# Altium schematic sheet INPUT BUFFER.SchDoc
size A3; CheckedBy: Alain.Zhu; CompanyName: TYMPHANY; DrawnBy: Yetta.He; Organization: PABU-BL3; Address1: 11F,block A, CEC building,; Address2: No.2070 Shennan Zhong road,; Address3: Huaqiang North, Futian District,; Address4: Shenzhen,  Guang Dong, P.R.C 518000; DocumentNumber: 5; Revision: 1.0.0; SheetNumber: 5; SheetTotal: 8; Size: A3; PCB By: Yetta.He; Status: DP1.1
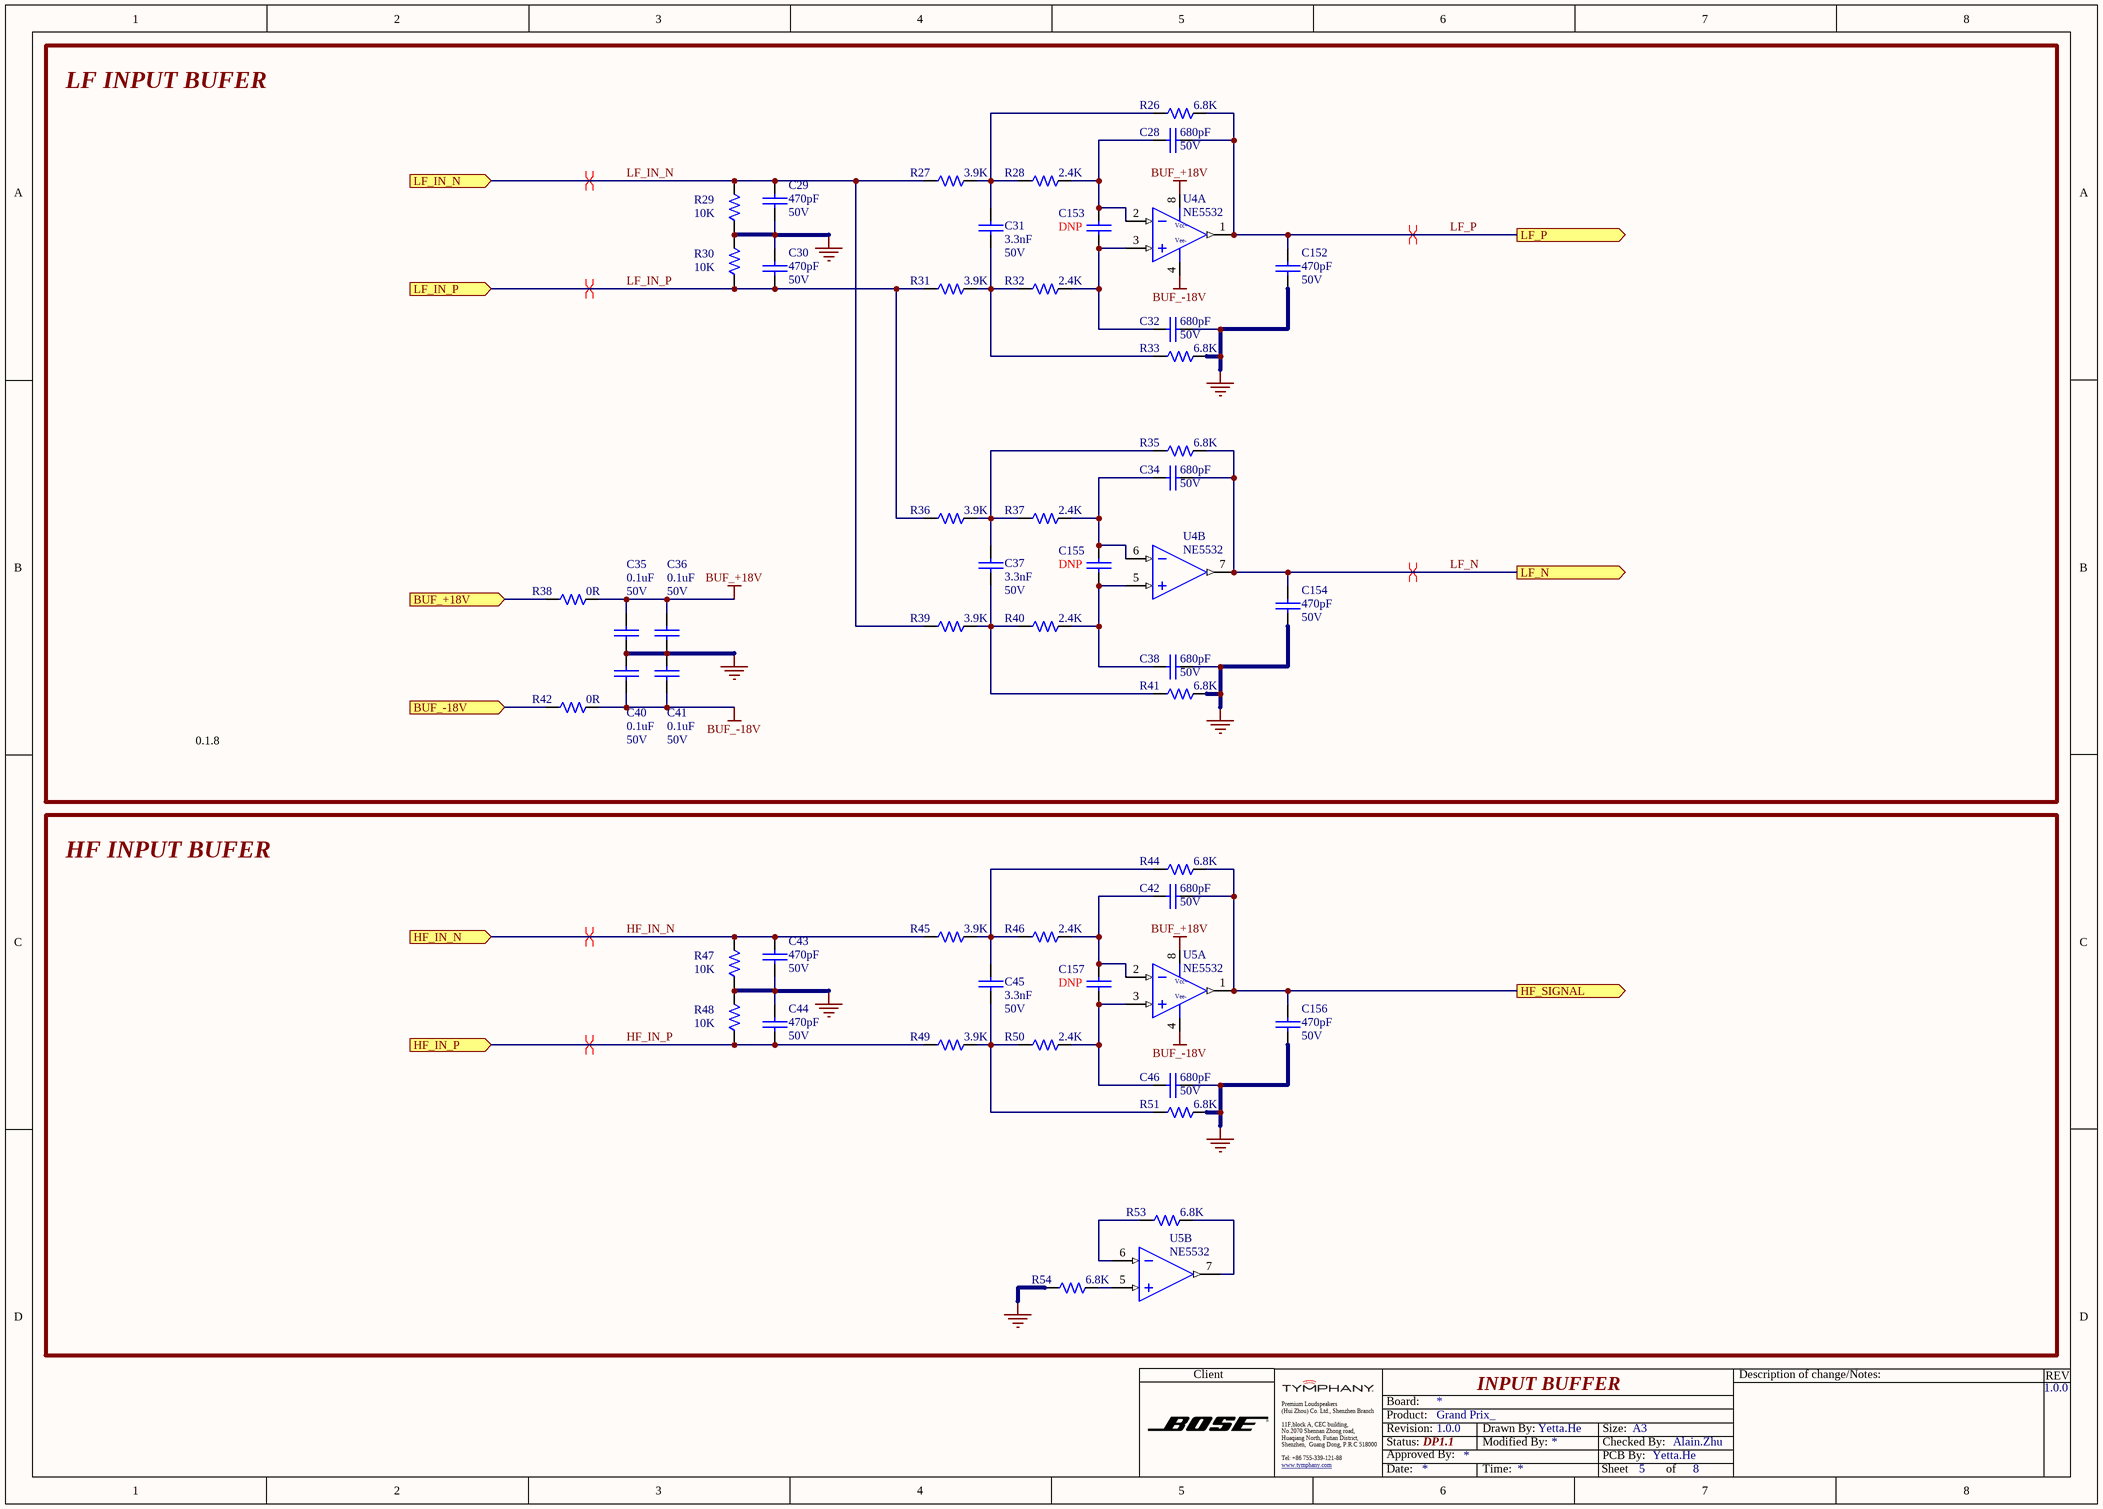
[diagram p0: INPUT BUFFER.SchDoc]

## Parts
C28  value 680pF  Voltage: 50V  [CAPC0603-RW]  (hidden comment: PXL410372-6810)
C29  value 470pF  Voltage: 50V  [CAPC0603-RW]  (hidden comment: PXL410370-4710)
C30  value 470pF  Voltage: 50V  [CAPC0603-RW]  (hidden comment: PXL410370-4710)
C31  value 3.3nF  Voltage: 50V  [CAPC0603-RW]  (hidden comment: PXL456470-3320)
C32  value 680pF  Voltage: 50V  [CAPC0603-RW]  (hidden comment: PXL410372-6810)
C34  value 680pF  Voltage: 50V  [CAPC0603-RW]  (hidden comment: PXL410372-6810)
C35  value 0.1uF  Voltage: 50V  [CAPC0603-RW]  (hidden comment: PXL456470-1040)
C36  value 0.1uF  Voltage: 50V  [CAPC0603-RW]  (hidden comment: PXL456470-1040)
C37  value 3.3nF  Voltage: 50V  [CAPC0603-RW]  (hidden comment: PXL456470-3320)
C38  value 680pF  Voltage: 50V  [CAPC0603-RW]  (hidden comment: PXL410372-6810)
C40  value 0.1uF  Voltage: 50V  [CAPC0603-RW]  (hidden comment: PXL456470-1040)
C41  value 0.1uF  Voltage: 50V  [CAPC0603-RW]  (hidden comment: PXL456470-1040)
C42  value 680pF  Voltage: 50V  [CAPC0603-RW]  (hidden comment: PXL410372-6810)
C43  value 470pF  Voltage: 50V  [CAPC0603-RW]  (hidden comment: PXL410370-4710)
C44  value 470pF  Voltage: 50V  [CAPC0603-RW]  (hidden comment: PXL410370-4710)
C45  value 3.3nF  Voltage: 50V  [CAPC0603-RW]  (hidden comment: PXL456470-3320)
C46  value 680pF  Voltage: 50V  [CAPC0603-RW]  (hidden comment: PXL410372-6810)
C152  value 470pF  Voltage: 50V  [CAPC0603-RW]  (hidden comment: PXL410370-4710)
C153  value DNP  [CAPC0603-RW]  (hidden comment: CAP0603 NC)
C154  value 470pF  Voltage: 50V  [CAPC0603-RW]  (hidden comment: PXL410370-4710)
C155  value DNP  [CAPC0603-RW]  (hidden comment: CAP0603 NC)
C156  value 470pF  Voltage: 50V  [CAPC0603-RW]  (hidden comment: PXL410370-4710)
C157  value DNP  [CAPC0603-RW]  (hidden comment: CAP0603 NC)
R26  value 6.8K  [0603-RW]  (hidden comment: QCF011030-6801)
R27  value 3.9K  [0603-RW]  (hidden comment: QCF011030-3901)
R28  value 2.4K  [0603-RW]  (hidden comment: QCF011030-2401)
R29  value 10K  [0603-RW]  (hidden comment: QCF011030-1002)
R30  value 10K  [0603-RW]  (hidden comment: QCF011030-1002)
R31  value 3.9K  [0603-RW]  (hidden comment: QCF011030-3901)
R32  value 2.4K  [0603-RW]  (hidden comment: QCF011030-2401)
R33  value 6.8K  [0603-RW]  (hidden comment: QCF011030-6801)
R35  value 6.8K  [0603-RW]  (hidden comment: QCF011030-6801)
R36  value 3.9K  [0603-RW]  (hidden comment: QCF011030-3901)
R37  value 2.4K  [0603-RW]  (hidden comment: QCF011030-2401)
R38  value 0R  [0603-RW]  (hidden comment: T502000002009)
R39  value 3.9K  [0603-RW]  (hidden comment: QCF011030-3901)
R40  value 2.4K  [0603-RW]  (hidden comment: QCF011030-2401)
R41  value 6.8K  [0603-RW]  (hidden comment: QCF011030-6801)
R42  value 0R  [0603-RW]  (hidden comment: T502000002009)
R44  value 6.8K  [0603-RW]  (hidden comment: QCF011030-6801)
R45  value 3.9K  [0603-RW]  (hidden comment: QCF011030-3901)
R46  value 2.4K  [0603-RW]  (hidden comment: QCF011030-2401)
R47  value 10K  [0603-RW]  (hidden comment: QCF011030-1002)
R48  value 10K  [0603-RW]  (hidden comment: QCF011030-1002)
R49  value 3.9K  [0603-RW]  (hidden comment: QCF011030-3901)
R50  value 2.4K  [0603-RW]  (hidden comment: QCF011030-2401)
R51  value 6.8K  [0603-RW]  (hidden comment: QCF011030-6801)
R53  value 6.8K  [0603-RW]  (hidden comment: QCF011030-6801)
R54  value 6.8K  [0603-RW]  (hidden comment: QCF011030-6801)
U4  MFG Part: NE5532  [SO8]  (hidden comment: RCI005532-0001)  (parts A,B of 2)
U5  MFG Part: NE5532  [SO8]  (hidden comment: RCI005532-0001)  (parts A,B of 2)

## Blocks framed on the sheet
LF INPUT BUFER: C28-C32 C34-C38 C40 C41 C152-C155 R26-R33 R35-R42 U4
HF INPUT BUFER: C42-C46 C156 C157 R44-R51 R53 R54 U5

## Ports
BUF_+18V (in), BUF_-18V (in), HF_IN_N (in), HF_IN_P (in), HF_SIGNAL (out), LF_IN_N (in), LF_IN_P (in), LF_N (out), LF_P (out)

## Nets
BUF_+18V: C35.1 C36.1 R38.2 U4.8 U5.8
BUF_-18V: C40.2 C41.2 R42.2 U4.4 U5.4
GND: C29.2 C30.1 C32.2 C35.2 C36.2 C38.2 C40.1 C41.1 C43.2 C44.1 C46.2 C152.2 C154.2 C156.2 R29.1 R30.2 R33.2 R41.2 R47.1 R48.2 R51.2 R54.1
BUF_+18V: R38.1 ; port BUF_+18V  [a separate net that carries the same name]
BUF_-18V: R42.1 ; port BUF_-18V  [a separate net that carries the same name]
HF_IN_N: C43.1 R45.1 R47.2 ; port HF_IN_N
HF_IN_P: C44.2 R48.1 R49.1 ; port HF_IN_P
HF_SIGNAL: C42.2 C156.1 R44.2 U5.1(OUT) ; port HF_SIGNAL
LF_IN_N: C29.1 R27.1 R29.2 R39.1 ; port LF_IN_N
LF_IN_P: C30.2 R30.1 R31.1 R36.1 ; port LF_IN_P
LF_N: C34.2 C154.1 R35.2 U4.7(OUT) ; port LF_N
LF_P: C28.2 C152.1 R26.2 U4.1(OUT) ; port LF_P
NetC28_1: C28.1 C153.1 R28.2 U4.2(IN-)
NetC31_1: C31.1 R26.1 R27.2 R28.1
NetC31_2: C31.2 R31.2 R32.1 R33.1
NetC32_1: C32.1 C153.2 R32.2 U4.3(IN+)
NetC34_1: C34.1 C155.1 R37.2 U4.6(IN-)
NetC37_1: C37.1 R35.1 R36.2 R37.1
NetC37_2: C37.2 R39.2 R40.1 R41.1
NetC38_1: C38.1 C155.2 R40.2 U4.5(IN+)
NetC42_1: C42.1 C157.1 R46.2 U5.2(IN-)
NetC45_1: C45.1 R44.1 R45.2 R46.1
NetC45_2: C45.2 R49.2 R50.1 R51.1
NetC46_1: C46.1 C157.2 R50.2 U5.3(IN+)
NetR53_1: R53.1 U5.6(IN-)
NetR53_2: R53.2 U5.7(OUT)
NetR54_2: R54.2 U5.5(IN+)

## Layout directives
differential pair: HF_IN_N, HF_IN_P, LF_IN_N, LF_IN_P, LF_N, LF_P

## Notes on the sheet
- 0.1.8
- INPUT BUFFER
- Client
- Description of change/Notes:
- REV
- Premium Loudspeakers
- (Hui Zhou) Co. Ltd., Shenzhen Branch
- Tel: +86 755-339-121-88
- Board:
- Status:
- Revision:
- Product:
- Approved By:
- Grand Prix_
- Drawn By:
- Modified By:
- Checked By:
- PCB By:
- Size:
- www.tymphany.com <http://www.tymphany.com>
- Date:
- Time:
- Sheet
- of
- (in symbol NE5532-10020355, part A) Vcc+; Vee-

## Library data of the parts
C28 C32 C34 C38 C42 C46 = CAP0603 680pF 50V 5% - PXL410372-6810: GP CHIP CAP 680pF 50V 5% 0603 NPO; SAP: T541026816508; Vendor Code: 10010262; Vendor Name: 东莞市晴远电子有限公司; Type: Capacitor; DIP&SMD: SMD; PACKAGE: CAPC0603; MFG: *; MFG Part: *; Other: NPO; Tolerance: 5%; Customer Specific: N/A
C29 C30 C43 C44 C152 C154 C156 = CAP0603 470pF 50V 5% - PXL410370-4710: GP CHIP CAP 470pF 50V 5% 0603 NPO; SAP: T541024716508; Vendor Code: 10010262; Vendor Name: 东莞市晴远电子有限公司; MFG: Walsin; Type: Capacitor; DIP&SMD: SMD; PACKAGE: CAPC0603; MFG Part: *; Other: NPO; Tolerance: 5%; Customer Specific: N/A
C31 C37 C45 = CAP0603 3.3nF 50V 10%: GP CHIP CAP 3.3nF 50V 10% 0603 X7R; SAP: T542023327508; Vendor Code: 10010262; Vendor Name: 东莞市晴远电子有限公司; Type: Capacitor; DIP&SMD: SMD; PACKAGE: CAPC0603; MFG: *; MFG Part: *; Other: X7R; Tolerance: 10%; Customer Specific: N/A
C35 C36 C40 C41 = CAP0603 0.1uF 50V 10% - PXL456470-1040: GP CHIP CAP 0.1uF 50V 10% 0603 TYPE X7R; SAP: T542021047508; Vendor Code: 10010262; Vendor Name: 东莞市晴远电子有限公司; Type: Capacitor; DIP&SMD: SMD; PACKAGE: CAPC0603; MFG: *; MFG Part: *; Other: X7R; Tolerance: 10%; Customer Specific: N/A
C153 C155 C157 = CAP0603 NC: NC; Type: Capacitor; CREATE_NAME: Tom; DIP&SMD: SMD; SAP: *; PACKAGE: CAPC0603; Vendor Code: *; Vendor Name: *; MFG: *; MFG Part: *; Other: *; Tolerance: *; CREATE_TIME: 18-Mar-2016; Voltage: *; Customer Specific: N/A
R26 R33 R35 R41 R44 R51 R53 R54 = RES0603 1/10W 1% 6.8K OHM: GP CHIP RES. 6.8K OHM 1/10W 1% 0603; Vendor Code: 10010262; SAP: T502680102399; Vendor Name: 东莞市晴远电子有限公司; DIP&SMD: SMD; Power: 1/10W; MFG Part: *; MFG: *; TOL: 1%; Type: Resistor; PACKAGE: 0603; Customer Specific: N/A
R27 R31 R36 R39 R45 R49 = RES0603 1/10W 1% 3.9K OHM: CHIP RES. 3.9K OHM 1/10W 1% 0603; Vendor Code: 10010262; SAP: T502390102399; Vendor Name: 东莞市晴远电子有限公司; DIP&SMD: SMD; Power: 1/10W; MFG Part: *; MFG: *; TOL: 1%; Type: Resistor; PACKAGE: 0603; Customer Specific: N/A
R28 R32 R37 R40 R46 R50 = RES0603 1/10W 1% 2.4K OHM: GP CHIP RES. 2.4K OHM 1/10W 1% 0603; Vendor Code: 10010262; SAP: T502240102399; Vendor Name: 东莞市晴远电子有限公司; DIP&SMD: SMD; Power: 1/10W; MFG Part: *; MFG: *; TOL: 1%; Type: Resistor; PACKAGE: 0603; Customer Specific: N/A
R29 R30 R47 R48 = RES0603 1/10W 1% 10K OHM: GP CHIP RES. 10K OHM 1/10W 1% 0603; Vendor Code: 10010262; SAP: T502100202399; Vendor Name: 东莞市晴远电子有限公司; DIP&SMD: SMD; Power: 1/10W; MFG Part: *; MFG: *; TOL: 1%; Type: Resistor; PACKAGE: 0603; Customer Specific: N/A
R38 R42 = RES0603 1/10W 0 OHM_WALSIN: CHIP 0 OHM 0 OHM 0 OHM 0603 WALSIN L; MFG Part: WR06X000PTL; Power: 1/10W; MFG: WALSIN (華新); DIP&SMD: SMD; Vendor Code: *; SAP: T502000002009; Vendor Name: *; TOL: *; Type: Resistor; PACKAGE: 0603; Customer Specific: N/A
U4 U5 = NE5532-10020355: INTEGRATED CIRCUITS NE5532 SO-8; SAP: T610500025401; MFG: TI; Vendor Name: SERIAL MICROELECTRONICS (HK) LIMITE; DIP&SMD: SMD; Vendor Code: 10020355; Type: IC; Customer Specific: N/A